# Altium schematic sheet cpu.SchDoc: GPN-Badge
size A4; Address4: Niklas Fauth; Revision: V2.0; SheetNumber: 3; SheetTotal: 3; PageSetup: Record=PageOptions|CenterHorizontal=True|CenterVertical=True|PrintScale=1.00|XCorrection=1.00|YCorrection=1.00|PrintKind=1|BorderSize=5000000|LeftOffset=0|BottomOffset=0|Orientation=2|PaperLength=1000|PaperWidth=1000|Scale=100|PaperSource=7|PrintQuality=-3|MediaType=1|DitherType=10|PrintScaleMode=1|PaperKind=12mm|PaperIndex=126
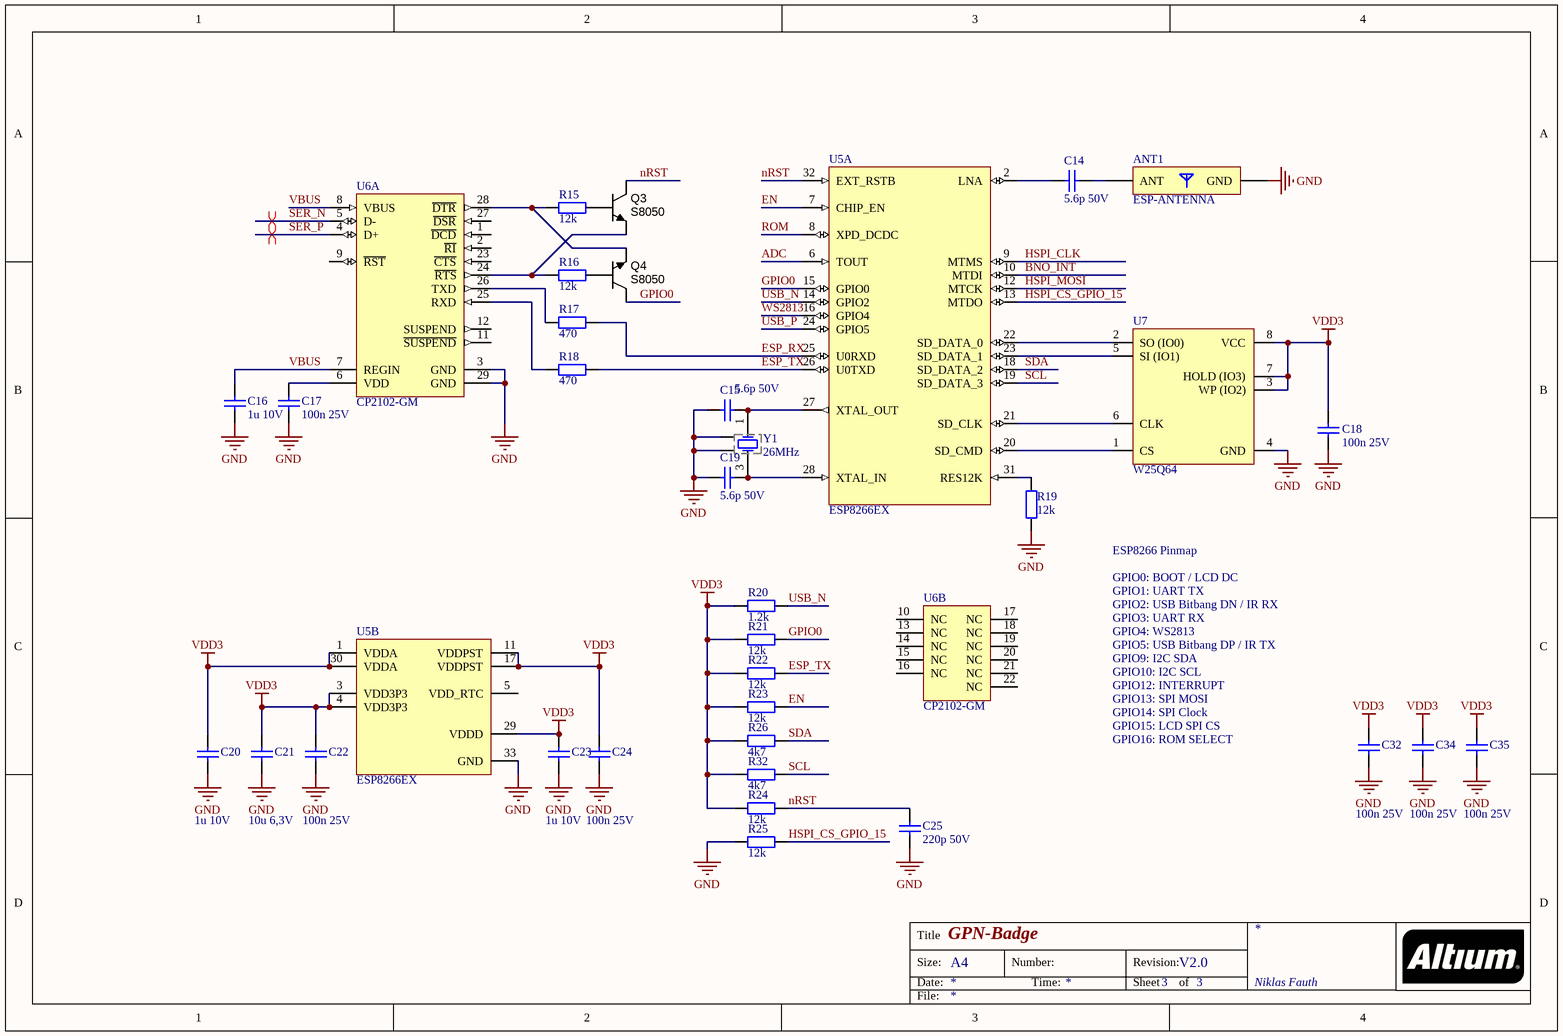
[diagram p0: cpu.SchDoc]

## Parts
(Parts that share a designator on the sheet are numbered #1, #2 ... from top to bottom, then left to right.)
ANT1  ESP-ANTENNA  [ESP8266_ANT]
C14  5.6p 50V  [C-0603-M]
C15  5.6p 50V  [C-0603-M]
C16  1u 10V  [C-0603-M]
C17  100n 25V  [C-0603-M]
C18  100n 25V  [C-0603-M]
C19  5.6p 50V  [C-0603-M]
C20  1u 10V  [C-0603-M]
C21  10u 6,3V  [C-0603-H]
C22  100n 25V  [C-0603-M]
C23  1u 10V  [C-0603-M]
C24  100n 25V  [C-0603-M]
C25  220p 50V  [C-0603-M]
C32  100n 25V  [C-0603-M]
C34  100n 25V  [C-0603-M]
C35  100n 25V  [C-0603-M]
Q3  Manufacturer Part Number 1: S8050  [SOT23-3]  (hidden comment: NPN_MMBT3904)
Q4  Manufacturer Part Number 1: S8050  [SOT23-3]  (hidden comment: NPN_MMBT3904)
R15  12k  [R-0603-M]
R16  12k  [R-0603-M]
R17  470  [R-0603-M]
R18  470  [R-0603-M]
R19  12k  [R-0603-M]
R20  1.2k  [R-0603-M]
R21  12k  [R-0603-M]
R22  12k  [R-0603-M]
R23  12k  [R-0603-M]
R24  12k  [R-0603-M]
R25  12k  [R-0603-M]
R26  4k7  [R-0603-M]
R32  4k7  [R-0603-M]
U5  ESP8266EX  [QFN32-5x5mm]  (parts A,B of 2)
U6#1  CP2102-GM  [SLAB-QFN-28-3125x3125TP_M]  (part A of 2)
U6#2  CP2102-GM  [SLAB-QFN-28-3125x3125TP_N]  (part B of 2)
U7  W25Q64  [SOIC127P790X100-8N]
Y1  26MHz  [3225]

## Nets
GND: ANT1.2(GND) C15.1 C16.1 C17.1 C18.1 C19.1 C20.1 C21.1 C22.1 C23.1 C24.1 C25.1 C32.1 C34.1 C35.1 R19.2 R25.1 U5.33(GND) U6#1.3(GND) U6#1.29(GND) U7.4(GND) Y1.2 Y1.4
VDD3: C18.2 C20.2 C21.2 C22.2 C23.2 C24.2 C32.2 C34.2 C35.2 R20.2 R21.1 R22.1 R23.1 R24.1 R26.1 R32.1 U5.1(VDDA) U5.3(VDD3P3) U5.4(VDD3P3) U5.11(VDDPST) U5.17(VDDPST) U5.29(VDDD) U5.30(VDDA) U7.3(WP_(IO2)) U7.7(HOLD_(IO3)) U7.8(VCC)
ADC: U5.6(TOUT)
BNO_INT: U5.10(MTDI)
EN: R23.2 U5.7(CHIP_EN)
ESP_RX: R17.2 U5.25(U0RXD)
ESP_TX: R18.2 R22.2 U5.26(U0TXD)
GPIO0: Q4.3(C) R21.2 U5.15(GPIO0)
HSPI_CLK: U5.9(MTMS)
HSPI_CS_GPIO_15: R25.2 U5.13(MTDO)
HSPI_MOSI: U5.12(MTCK)
nRST: C25.2 Q3.3(C) R24.2 U5.32(EXT_RSTB)
ROM: U5.8(XPD_DCDC)
SCL: R32.2 U5.19(SD_DATA_3)
SDA: R26.2 U5.18(SD_DATA_2)
SER_N: U6#1.5(D-)
SER_P: U6#1.4(D+)
USB_N: R20.1 U5.14(GPIO2)
USB_P: U5.24(GPIO5)
VBUS: C16.2 U6#1.7(REGIN) U6#1.8(VBUS)
WS2813: U5.16(GPIO4)
NetANT1_1: ANT1.1(ANT) C14.2
NetC14_1: C14.1 U5.2(LNA)
NetC15_2: C15.2 U5.27(XTAL_OUT) Y1.1
NetC17_2: C17.2 U6#1.6(VDD)
NetC19_2: C19.2 U5.28(XTAL_IN) Y1.3
NetQ3_1: Q3.1(B) R15.2
NetQ3_2: Q3.2(E) R16.1 U6#1.24(~{RTS})
NetQ4_1: Q4.1(B) R16.2
NetQ4_2: Q4.2(E) R15.1 U6#1.28(~{DTR})
NetR17_1: R17.1 U6#1.26(TXD)
NetR18_1: R18.1 U6#1.25(RXD)
NetR19_1: R19.1 U5.31(RES12K)
NetU5_20: U5.20(SD_CMD) U7.1(CS)
NetU5_21: U5.21(SD_CLK) U7.6(CLK)
NetU5_22: U5.22(SD_DATA_0) U7.2(SO_(IO0))
NetU5_23: U5.23(SD_DATA_1) U7.5(SI_(IO1))

Not connected (* = marked no-connect by the designer): U5 5(VDD_RTC); U6#1 1(~{DCD}) 2(~{RI}) 9(~{RST}) 11(~{SUSPEND}) 12(SUSPEND) 23(~{CTS}) 27(~{DSR}); U6#2 10(NC) 13(NC) 14(NC) 15(NC) 16(NC) 17(NC) 18(NC) 19(NC) 20(NC) 21(NC) 22(NC)

## Layout directives
differential pair: SER_N, SER_P

## Notes on the sheet
- GPIO0: BOOT / LCD DC
- ESP8266 Pinmap
- GPIO1: UART TX
- GPIO3: UART RX
- GPIO2: USB Bitbang DN / IR RX
- GPIO4: WS2813
- GPIO5: USB Bitbang DP / IR TX
- GPIO9: I2C SDA
- GPIO10: I2C SCL
- GPIO12: INTERRUPT
- GPIO13: SPI MOSI
- GPIO14: SPI Clock
- GPIO15: LCD SPI CS
- GPIO16: ROM SELECT
- Title
- Size:
- Date:
- A4
- Number:
- Time:
- Revision:
- Sheet
- of
- File:

## Library data of the parts
ANT1 = ESP-ANT
C14 C15 C19 = C-0603-5p6-50V: Capacitor 5.6pF 50V; Supplier 1: Mouser; Supplier Part Number 1: 80-C0603C569C5GACTM
C16 C20 C23 = C-0603-1u-10V: Capacitor 1uF 10V; Supplier 1: Mouser; Supplier Part Number 1: 80-C0603C105K8P
C17 C18 C22 C24 C32 C34 C35 = C-0603-100n-25V: Capacitor 100n 25V; Supplier 1: Mouser; Supplier Part Number 1: 80-C0603C104K3R
C21 = C-0603-10u-6,3V: Capacitor 10uF 6,3V; Supplier 1: Mouser; Supplier Part Number 1: 80-C0603C106M9P
C25 = C-0603-220p-50V: Capacitor 220p 50V; Supplier 1: Mouser; Supplier Part Number 1: 80-C0603C221F5GAC
Q3 Q4 = NPN_MMBT3904: Transistor SMD NPN 40V 0.2A 250mW SOT-23; Manufacturer 1: Fairchild Semiconductor; Ratings: 40V; 200mA; 250mW; Material: Si; SCDType: source; Package / Case: SOT-23; Supplier 1: Digi-Key; Supplier Part Number 1: MMBT3904FSCT-ND; Transistor Type: NPN; Mounting Type: Surface Mount; Supplier 2: Digi-Key; Supplier Part Number 2: 568-1741-1-ND; Manufacturer 2: NXP Semiconductors; Manufacturer Part Number 2: PMBT3904,215; ComponentLink2URL: http://www.nxp.com/documents/data_sheet/PMBT3904.pdf; ComponentLink2Description: http://www.nxp.com/documents/data_sheet/PMBT3904.pdf; ComponentLink1URL: http://www.fairchildsemi.com/ds/MM/MMBT3904.pdf; ComponentLink1Description: http://www.fairchildsemi.com/ds/MM/MMBT3904.pdf
R15 R16 R19 R21-R25 = R-0603-12k: Resistor 12k; Supplier 1: Mouser; Supplier Part Number 1: 71-CRCW0603-12K-E3
R17 R18 = R-0603-470: Resistor 470; Supplier 1: Mouser; Supplier Part Number 1: 71-CRCW0603-470K-E3
R20 = R-0603-1k2: Resistor 1.2k
R26 R32 = R-0603-4k7: Resistor 4k7; Supplier 1: Mouser; Supplier Part Number 1: 71-CRCW0603-4.7K-E3
U6#1 U6#2 = CMP-0511-00012-1: Single-Chip USB to UART Bridge, 1024 Bytes EEPROM, -40 to 85 degC, 28-pin QFN, Tube; Manufacturer: Silicon Labs; Internal Oscillator: TRUE; Sub-Family: USB Bridges; ComponentLink3Description: Package Specification; PackageDescription: 28-Pin Quad-Flat No-Leads Package, Body 5 x 5 mm, Pitch 0.5 mm; PartNumber: CP2102-GM; EEPROM: 1024 Bytes; Mounting Technology: Surface Mount; ComponentLink2URL: http://www.silabs.com/Support%20Documents/TechnicalDocs/CP2102-9.pdf; DatasheetVersion: Rev. 1.5; ComponentLink1URL: http://www.silabs.com/; ComponentLink2Description: Datasheet; Code_JEDEC: MO-220; PackageReference: QFN-28; Code_IPC: J-STD-020C; ComponentLink3URL: http://www.silabs.com/Support%20Documents/TechnicalDocs/C8051T61x.pdf; ComponentLink1Description: Manufacturer URL; PartId: 1
U7 = W25Q64: 8MB / 64Mib Flash
Y1 = 3225-26MHz